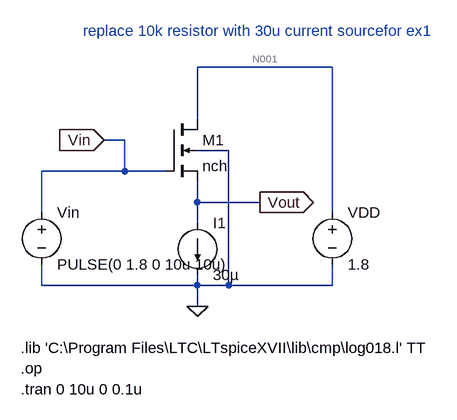
[diagram p0: schematic Week 3 Exc1.asc]
Week 3 Exc1.asc, the LTspice schematic file:
Version 4
SHEET 1 880 680
WIRE 560 -64 352 -64
WIRE 352 16 352 -64
WIRE 240 48 208 48
WIRE 400 64 352 64
WIRE 240 96 240 48
WIRE 240 96 112 96
WIRE 304 96 240 96
WIRE 352 144 352 112
WIRE 448 144 352 144
WIRE 112 160 112 96
WIRE 560 160 560 -64
WIRE 352 176 352 144
WIRE 112 272 112 240
WIRE 352 272 352 256
WIRE 352 272 112 272
WIRE 400 272 400 64
WIRE 400 272 352 272
WIRE 560 272 560 240
WIRE 560 272 400 272
WIRE 352 304 352 272
FLAG 352 304 0
FLAG 448 144 Vout
IOPIN 448 144 Out
FLAG 208 48 Vin
IOPIN 208 48 In
SYMBOL voltage 112 144 R0
WINDOW 123 0 0 Left 0
WINDOW 39 0 0 Left 0
SYMATTR InstName Vin
SYMATTR Value PULSE(0 1.8 0 10u 10u)
SYMBOL nmos4 304 16 R0
SYMATTR InstName M1
SYMATTR Value nch
SYMATTR Value2 l=1u w=1u
SYMBOL voltage 560 144 R0
WINDOW 123 0 0 Left 0
WINDOW 39 0 0 Left 0
SYMATTR InstName VDD
SYMATTR Value 1.8
SYMBOL current 352 176 R0
WINDOW 123 0 0 Left 0
WINDOW 39 0 0 Left 0
SYMATTR InstName I1
SYMATTR Value 30µ
TEXT 80 400 Left 2 !.op
TEXT 80 368 Left 2 !.lib 'C:\\Program Files\\LTC\\LTspiceXVII\\lib\\cmp\\log018.l' TT
TEXT 80 432 Left 2 !.tran 0 10u 0 0.1u
TEXT 176 -120 Left 2 ;replace 10k resistor with 30u current sourcefor ex1

The netlist it stands for:
* Week 3 Exc1.asc
Vin Vin 0 PULSE(0 1.8 0 10u 10u)
M1 N001 Vin Vout 0 nch l=1u w=1u
VDD N001 0 1.8
I1 Vout 0 30µ
.model NMOS NMOS
.model PMOS PMOS
.lib standard.mos
.op
.lib 'C:\Program Files\LTC\LTspiceXVII\lib\cmp\log018.l' TT
.tran 0 10u 0 0.1u
* replace 10k resistor with 30u current sourcefor ex1
.backanno
.end

* Results of the author's LTspice run, read from the files saved beside the schematic
* Operating Point, zero values left out:
*   V(n001) = 1.8 V
*   V(vout) = -555.7 mV
*   Id(M1) = 8.572 µA
*   Ib(M1) = 21.43 µA
*   Is(M1) = -30 µA
*   I(I1) = 30 µA
*   I(Vdd) = -8.572 µA
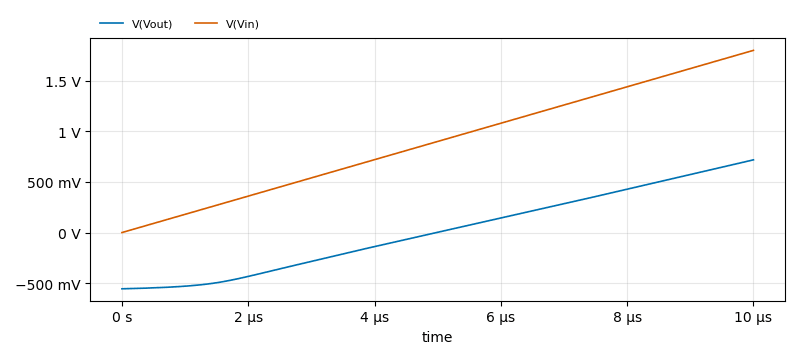
[diagram p1: Transient Analysis of Week 3 Exc1.asc, plotted from the saved traces]
* Transient Analysis, 1 run:
*   V(Vout): min -555.7 mV, max 718.3 mV, average 11.57 mV, rms 410.1 mV, last 718.3 mV
*   V(Vin): min 0 V, max 1.8 V, average 900 mV, rms 1.047 V, last 1.8 V